# Altium schematic sheet Sheet2.SchDoc
size A4; SheetNumber: 2; SheetTotal: 2
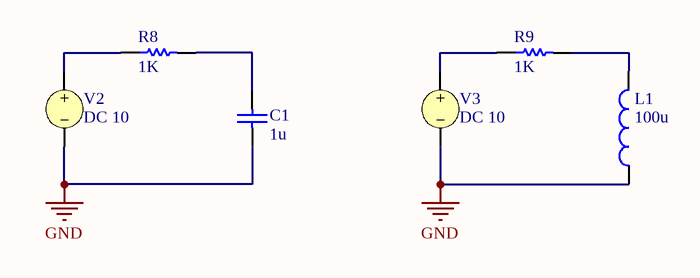
[diagram p0: Sheet2.SchDoc]

## Parts
C1  value 1u  (hidden comment: Capacitor)
L1  value 100u  (hidden comment: Inductor)
R8  value 1K  (hidden comment: Resistor)
R9  value 1K  (hidden comment: Resistor)
V2  DC 10
V3  DC 10

## Nets
GND: C1.1 L1.1 V2.2 V3.2
NetC1_2: C1.2 R8.2
NetL1_2: L1.2 R9.2
NetR8_1: R8.1 V2.1
NetR9_1: R9.1 V3.1

## Library data of the parts
C1 = Capacitor: SimulationGenericComponent: True
L1 = Inductor: SimulationGenericComponent: True
R8 R9 = Resistor: TC1: 0; SimulationGenericComponent: True; TC2: 0
V2 V3 = VSRC: Voltage Source; Note: PCB Footprint - Not required; AC Magnitude: 1; AC Phase: 0; Value: 10; Published: 8-Jun-2000; LatestRevisionDate: 17-Jul-2002; LatestRevisionNote: Re-released for DXP Platform.; PackageReference: Not Applicable; Publisher: Altium Limited